# Altium project TIDA-010954-RevB.PrjPcb (part 6 of 6)
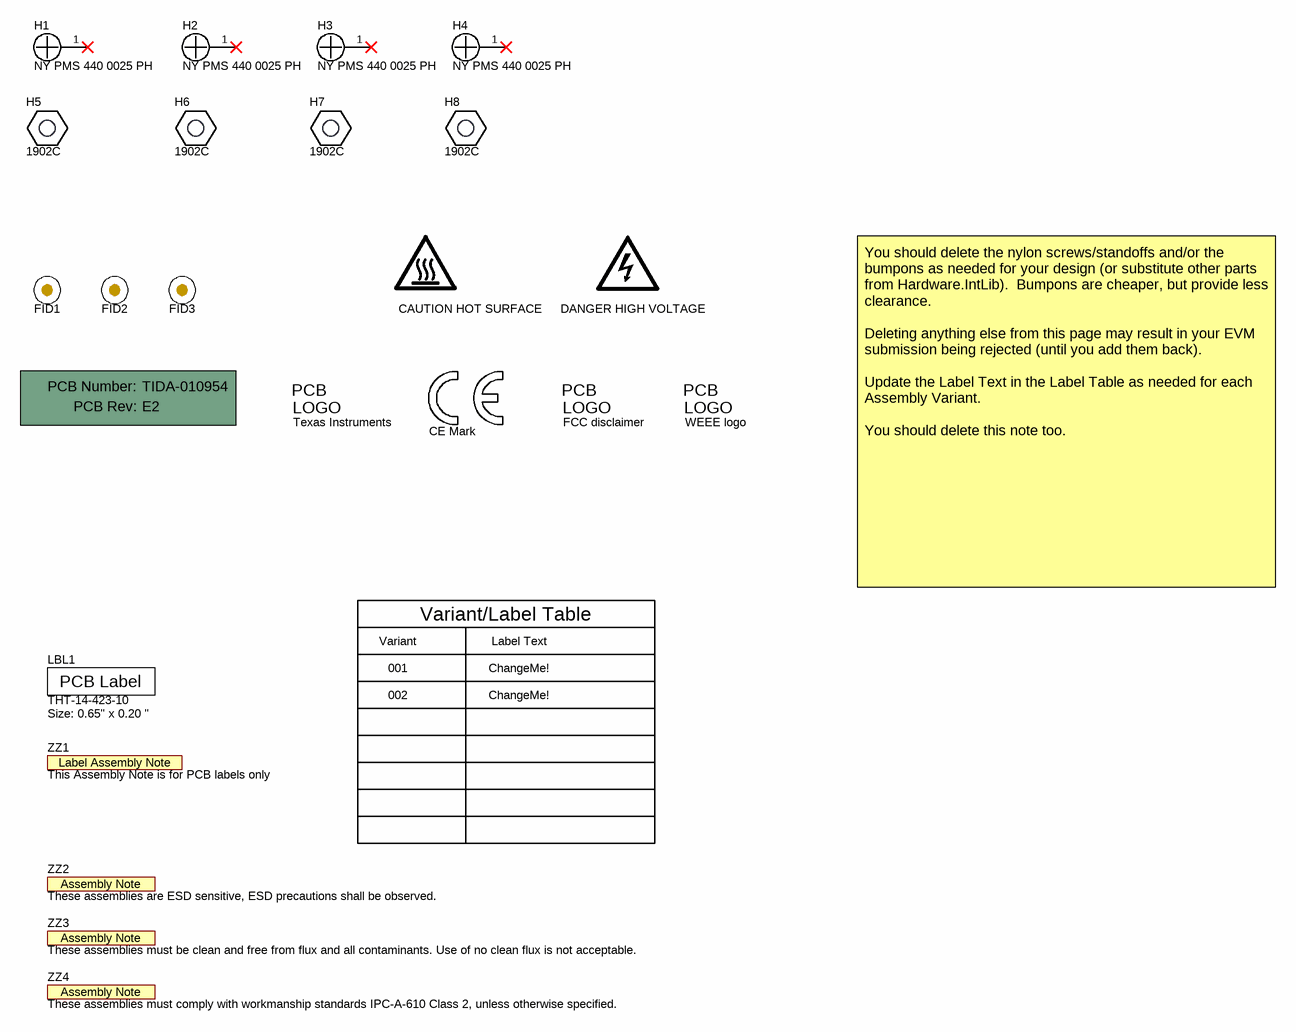
[diagram p9: TIDA-010954-Hardware.SchDoc]

## Nets that join several sheets
3V3: TIDA-010954-Power (C103.1 R62.2 U13.5), TIDA-010954-Input (5 pins), TIDA-010954-Output (6 pins), TIDA-010954-Cycloconverter (10 pins), Cycloconverter/S1 (S1C2.1 S1C86.1 S1U1.1 S1U2.16), TIDA-010954-FullBridge (R25.1), Cycloconverter/S2 (S2C2.1 S2C86.1 S2U1.1 S2U2.16), TIDA-010954-Control (5 pins)
5V: TIDA-010954-Power (10 pins), Cycloconverter/S1 (S1C15.1 S1L2.2), TIDA-010954-FullBridge (C20.2 C29.2 R16.1 R26.1), Cycloconverter/S2 (S2C15.1 S2L2.2), TIDA-010954-Control (J10.48 J10.84 J10.98 J10.112)
GND: TIDA-010954-Power (17 pins), TIDA-010954-Input (12 pins), TIDA-010954-Output (12 pins), TIDA-010954-Cycloconverter (12 pins), Cycloconverter/S1 (17 pins), TIDA-010954-FullBridge (17 pins), Cycloconverter/S2 (17 pins), TIDA-010954-Control (41 pins)
PE: TIDA-010954-Top (J5.1), TIDA-010954-Output (6 pins)
PGND: TIDA-010954-Input (8 pins), TIDA-010954-Cycloconverter (22 pins), TIDA-010954-FullBridge (12 pins)
5V_GOOD: TIDA-010954-Power (R57.1 R61.2 U12.6), TIDA-010954-Control (D12.1)
AC_CS: TIDA-010954-Output (C97.1 R101.1 TP6.1), TIDA-010954-Control (C114.1 J10.23)
AC_CS_FLT: TIDA-010954-Output (U14.4 U14.7), TIDA-010954-Control (J11.5 R64.1)
AC_VS: TIDA-010954-Output (C135.1 R111.2 TP15.1), TIDA-010954-Control (C113.1 J10.39)
DA: TIDA-010954-Output (L8.1), TIDA-010954-Cycloconverter (6 pins), Cycloconverter/S1 (S1A.9 S1D1.2 S1R2.2)
DA: TIDA-010954-Cycloconverter (L4.1 L4.2 L5.2 TP27.1), Cycloconverter/S1 (S1B.9 S1D1.1 S1R3.1), Cycloconverter/S2 (S2A.9 S2D1.2 S2R2.2)
DAB_POWER: TIDA-010954-Cycloconverter (21 pins), TIDA-010954-FullBridge (8 pins)
DB: TIDA-010954-Output (L10.1), TIDA-010954-Cycloconverter (6 pins), Cycloconverter/S2 (S2B.9 S2D1.1 S2R3.1)
DC_CS: TIDA-010954-Input (C90.1 R46.1 TP16.1), TIDA-010954-Control (C116.1 J10.31)
DC_VS: TIDA-010954-Input (C92.1 R50.1 TP18.1), TIDA-010954-Control (C115.1 J10.33)
~{FAULT}: TIDA-010954-FullBridge (C24.2 R25.2 U5.16 U6.16), TIDA-010954-Control (J11.6 R72.1)
FB_TMP: TIDA-010954-Cycloconverter (C75.1 R43.1), TIDA-010954-Control (C107.2 J10.17)
L_EXT: TIDA-010954-Top (J2.1 TP3.1), TIDA-010954-Output (F1.2)
N_EXT: TIDA-010954-Top (J4.1 TP5.1), TIDA-010954-Output (F2.2)
PRI_CS: TIDA-010954-Cycloconverter (C16.1 R37.2 TP9.1), TIDA-010954-Control (C38.1 J10.25)
PVIN: TIDA-010954-Top (J1.1 TP2.1), TIDA-010954-Power (J7.2), TIDA-010954-Input (6 pins), TIDA-010954-Cycloconverter (L3.1)
PVRTN: TIDA-010954-Top (J3.1 TP4.1), TIDA-010954-Input (R44.1 R47.1)
Q1_G: TIDA-010954-FullBridge (R15.1 R17.2), TIDA-010954-Control (J6.5 R75.2)
Q1_ZVD: TIDA-010954-FullBridge (U5.2), TIDA-010954-Control (R90.1)
Q2_G: TIDA-010954-FullBridge (R21.1 R24.2), TIDA-010954-Control (J6.6 R77.2)
Q2_ZVD: TIDA-010954-FullBridge (U5.1), TIDA-010954-Control (R91.1)
Q3_G: TIDA-010954-FullBridge (R27.1 R28.2), TIDA-010954-Control (J6.7 R79.2)
Q3_ZVD: TIDA-010954-FullBridge (U6.2), TIDA-010954-Control (R92.1)
Q4_G: TIDA-010954-FullBridge (R32.1 R35.2), TIDA-010954-Control (J6.8 R81.2)
Q4_ZVD: TIDA-010954-FullBridge (U6.1), TIDA-010954-Control (R93.1)
REF: TIDA-010954-Input (C94.1 R54.1), TIDA-010954-Output (C136.2 C137.1 R118.1 R119.2), TIDA-010954-Control (C112.1 J10.24)
S1_PWR_FLT: Cycloconverter/S1 (S1R11.1 S1U4.1), TIDA-010954-Control (J11.3 R83.1)
S1_TMP: Cycloconverter/S1 (S1C1.1 S1R1.2), TIDA-010954-Control (C109.2 J10.9)
S1A_FLT: Cycloconverter/S1 (S1U2.12), TIDA-010954-Control (J11.10 R67.1)
S1A_G: Cycloconverter/S1 (S1R4.2), TIDA-010954-Control (J6.9 R74.1)
S1A_ZVD: Cycloconverter/S1 (S1U2.13), TIDA-010954-Control (R86.1)
S1B_FLT: Cycloconverter/S1 (S1U2.14), TIDA-010954-Control (J11.9 R69.1)
S1B_G: Cycloconverter/S1 (S1R6.2), TIDA-010954-Control (J6.11 R78.1)
S1B_ZVD: Cycloconverter/S1 (S1U2.15), TIDA-010954-Control (R87.1)
S2_PWR_FLT: Cycloconverter/S2 (S2R11.1 S2U4.1), TIDA-010954-Control (J11.2 R85.1)
S2_TMP: Cycloconverter/S2 (S2C1.1 S2R1.2), TIDA-010954-Control (C108.2 J10.11)
S2A_FLT: Cycloconverter/S2 (S2U2.12), TIDA-010954-Control (J11.8 R70.1)
S2A_G: Cycloconverter/S2 (S2R4.2), TIDA-010954-Control (J6.10 R76.1)
S2A_ZVD: Cycloconverter/S2 (S2U2.13), TIDA-010954-Control (R88.1)
S2B_FLT: Cycloconverter/S2 (S2U2.14), TIDA-010954-Control (J11.7 R71.1)
S2B_G: Cycloconverter/S2 (S2R6.2), TIDA-010954-Control (J6.12 R80.1)
S2B_ZVD: Cycloconverter/S2 (S2U2.15), TIDA-010954-Control (R89.1)
S_PWR: Cycloconverter/S1 (S1R11.2), Cycloconverter/S2 (S2R11.2), TIDA-010954-Control (J10.99 R84.2)
SEC_CS: TIDA-010954-Cycloconverter (C17.1 R36.2 TP8.1), TIDA-010954-Control (C39.1 J10.34 J10.36)
SW_L1: TIDA-010954-Cycloconverter (11 pins), TIDA-010954-FullBridge (U5.5)
SW_L2: TIDA-010954-Cycloconverter (TP13.1 U7.2), TIDA-010954-FullBridge (U6.5)
XFMR_CS_FLT: TIDA-010954-Cycloconverter (U7.4 U7.7 U8.4 U8.7), TIDA-010954-Control (J11.4 R66.1)

## Assembly variants
001 Assemble: not fitted C70 C71 C72 C74 C76 C77 C78 C79 C81 C82 C83 C84 C85 FID1 FID2 FID3 L4 L5 R54 R54 R94 S1D1 S1R2 S1R3 S2D1 S2R2 S2R3 T1 T2
001_No magnetics: not fitted FID1 FID2 FID3 L4 L5 R54 R54 R94 T1 T2
001_WE: not fitted FID1 FID2 FID3 L5 R54 R54 R94 T1
001_Bourns: not fitted C70 C71 C72 C74 C76 C77 C78 C79 FID1 FID2 FID3 L4 R54 R54 R94 S1D1 S1R2 S1R3 S2D1 S2R2 S2R3 T2
001: not fitted C45 C46 C69 FID1 FID2 FID3 R54 R54 R94 T1 T2